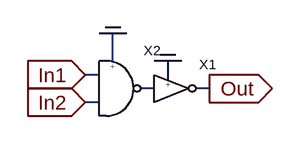
[diagram p0: schematic nm_and.asc]
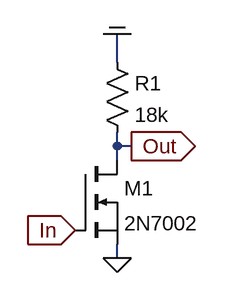
[diagram p1: sub-circuit nm_not.asc]
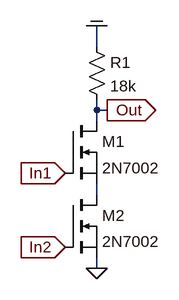
[diagram p2: sub-circuit nm_nand.asc]
nm_and.asc, the LTspice schematic file:
Version 4
SHEET 1 880 680
WIRE 128 96 128 64
WIRE 112 112 96 112
WIRE 192 112 192 96
WIRE 176 128 160 128
WIRE 240 128 224 128
WIRE 112 144 96 144
FLAG 96 112 In1
IOPIN 96 112 In
FLAG 240 128 Out
IOPIN 240 128 Out
FLAG 192 96 COM
FLAG 96 144 In2
IOPIN 96 144 In
FLAG 128 64 COM
SYMBOL nm_not 192 128 R0
SYMATTR InstName X1
SYMBOL nm_nand 128 128 R0
SYMATTR InstName X2

nm_not.asc, the sub-circuit schematic file:
Version 4
SHEET 1 880 680
WIRE 224 32 224 0
WIRE 224 128 224 112
WIRE 240 128 224 128
WIRE 224 144 224 128
WIRE 224 256 224 240
FLAG 224 256 0
FLAG 176 224 In
IOPIN 176 224 In
FLAG 240 128 Out
IOPIN 240 128 Out
FLAG 224 0 COM
SYMBOL nmos 176 144 R0
SYMATTR InstName M1
SYMATTR Value 2N7002
SYMBOL res 208 16 R0
SYMATTR InstName R1
SYMATTR Value 18k

nm_nand.asc, the sub-circuit schematic file:
Version 4
SHEET 1 880 680
WIRE 224 32 224 0
WIRE 224 128 224 112
WIRE 240 128 224 128
WIRE 224 144 224 128
WIRE 224 256 224 240
WIRE 224 368 224 352
FLAG 176 224 In1
IOPIN 176 224 In
FLAG 240 128 Out
IOPIN 240 128 Out
FLAG 224 0 COM
FLAG 224 368 0
FLAG 176 336 In2
IOPIN 176 336 In
SYMBOL nmos 176 144 R0
SYMATTR InstName M1
SYMATTR Value 2N7002
SYMBOL res 208 16 R0
SYMATTR InstName R1
SYMATTR Value 18k
SYMBOL nmos 176 256 R0
SYMATTR InstName M2
SYMATTR Value 2N7002

The netlist it stands for:
* nm_and.asc
XX1 N001 Out COM nm_not
XX2 In2 N001 COM In1 nm_nand

* block symbol definitions
.subckt nm_not In Out COM
M1 Out In 0 0 2N7002
R1 COM Out 18k
.ends nm_not

.subckt nm_nand In2 Out COM In1
M1 Out In1 N001 N001 2N7002
R1 COM Out 18k
M2 N001 In2 0 0 2N7002
.ends nm_nand

.model NMOS NMOS
.model PMOS PMOS
.lib standard.mos
.backanno
.end